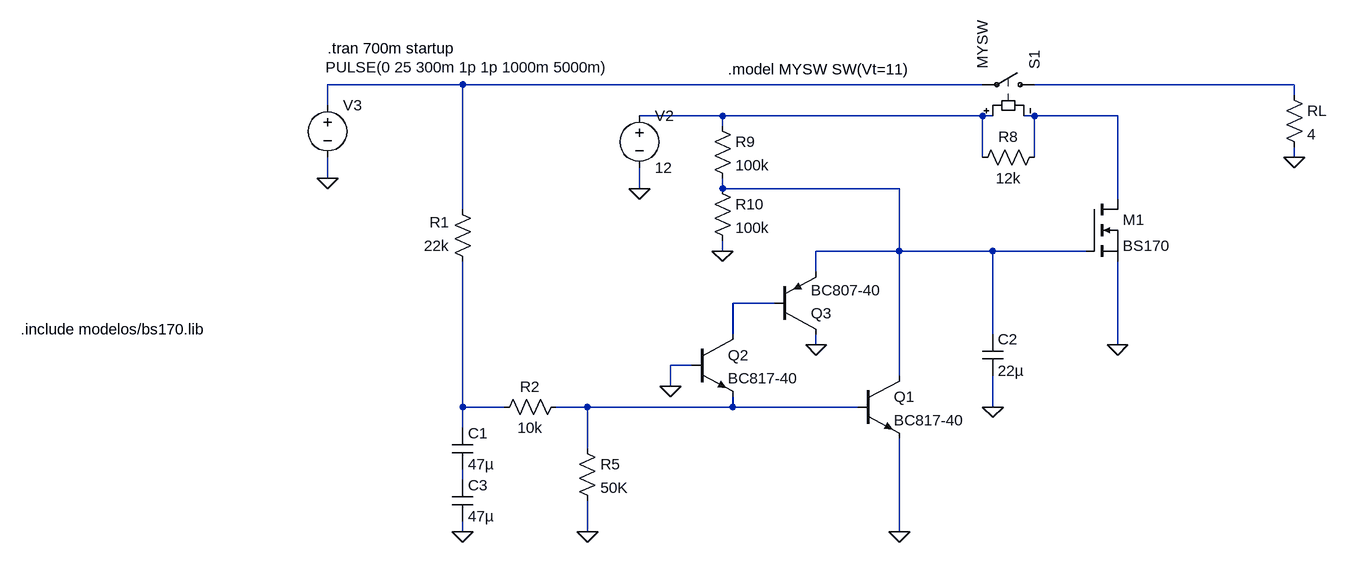
[diagram p0: schematic proteccion_parlante_DC.asc]
proteccion_parlante_DC.asc, the LTspice schematic file:
Version 4
SHEET 1 1752 680
WIRE -304 -304 -512 -304
WIRE 496 -304 -304 -304
WIRE 976 -304 576 -304
WIRE 976 -288 976 -304
WIRE -512 -272 -512 -304
WIRE 96 -256 -32 -256
WIRE 496 -256 96 -256
WIRE 512 -256 496 -256
WIRE 576 -256 560 -256
WIRE 704 -256 576 -256
WIRE 96 -240 96 -256
WIRE 496 -192 496 -256
WIRE 576 -192 576 -256
WIRE 976 -192 976 -208
WIRE -512 -160 -512 -192
WIRE -32 -144 -32 -176
WIRE 96 -144 96 -160
WIRE 368 -144 96 -144
WIRE 704 -128 704 -256
WIRE -304 -112 -304 -304
WIRE 96 -48 96 -64
WIRE 368 -48 368 -144
WIRE 368 -48 240 -48
WIRE 512 -48 368 -48
WIRE 656 -48 512 -48
WIRE 240 -16 240 -48
WIRE 176 32 112 32
WIRE 112 80 112 32
WIRE 512 80 512 -48
WIRE 240 96 240 80
WIRE 704 96 704 -32
WIRE 48 128 16 128
WIRE 368 144 368 -48
WIRE 16 160 16 128
WIRE -304 192 -304 -32
WIRE -240 192 -304 192
WIRE -112 192 -160 192
WIRE 112 192 112 176
WIRE 112 192 -112 192
WIRE 304 192 112 192
WIRE 512 192 512 144
WIRE -304 224 -304 192
WIRE -112 256 -112 192
WIRE -304 304 -304 288
WIRE -304 384 -304 368
WIRE -112 384 -112 336
WIRE 368 384 368 240
FLAG -304 384 0
FLAG 368 384 0
FLAG -32 -144 0
FLAG 512 192 0
FLAG 704 96 0
FLAG 240 96 0
FLAG 16 160 0
FLAG -112 384 0
FLAG 976 -192 0
FLAG -512 -160 0
FLAG 96 -48 0
SYMBOL cap -320 224 R0
SYMATTR InstName C1
SYMATTR Value 47µ
SYMBOL res -144 176 R90
WINDOW 0 0 56 VBottom 2
WINDOW 3 32 56 VTop 2
SYMATTR InstName R2
SYMATTR Value 10k
SYMBOL npn 304 144 R0
SYMATTR InstName Q1
SYMATTR Value BC817-40
SYMBOL voltage -32 -272 R0
WINDOW 123 0 0 Left 2
WINDOW 39 0 0 Left 2
SYMATTR InstName V2
SYMATTR Value 12
SYMBOL cap 496 80 R0
SYMATTR InstName C2
SYMATTR Value 22µ
SYMBOL nmos 656 -128 R0
SYMATTR InstName M1
SYMATTR Value BS170
SYMBOL res -288 -16 R180
WINDOW 0 36 76 Left 2
WINDOW 3 36 40 Left 2
SYMATTR InstName R1
SYMATTR Value 22k
SYMBOL npn 48 80 R0
SYMATTR InstName Q2
SYMATTR Value BC817-40
SYMBOL pnp 176 80 M180
SYMATTR InstName Q3
SYMATTR Value BC807-40
SYMBOL res -128 240 R0
SYMATTR InstName R5
SYMATTR Value 50K
SYMBOL sw 592 -304 M270
SYMATTR InstName S1
SYMATTR Value MYSW
SYMBOL res 960 -304 R0
SYMATTR InstName RL
SYMATTR Value 4
SYMBOL res 592 -208 R90
WINDOW 0 0 56 VBottom 2
WINDOW 3 32 56 VTop 2
SYMATTR InstName R8
SYMATTR Value 12k
SYMBOL voltage -512 -288 R0
WINDOW 123 0 0 Left 2
WINDOW 39 0 0 Left 2
WINDOW 3 -3 -43 Left 2
SYMATTR InstName V3
SYMATTR Value PULSE(0 25 300m 1p 1p 1000m 5000m)
SYMBOL res 80 -256 R0
SYMATTR InstName R9
SYMATTR Value 100k
SYMBOL res 80 -160 R0
SYMATTR InstName R10
SYMATTR Value 100k
SYMBOL cap -320 304 R0
SYMATTR InstName C3
SYMATTR Value 47µ
TEXT -512 -360 Left 2 !.tran 700m startup
TEXT 104 -328 Left 2 !.model MYSW SW(Vt=11)
TEXT -984 72 Left 2 !.include modelos/bs170.lib

The netlist it stands for:
* proteccion_parlante_DC.asc
C1 N007 N009 47µ
R2 N008 N007 10k
Q1 N005 N008 0 0 BC817-40
V2 N003 0 12
C2 N005 0 22µ
M1 N004 N005 0 0 BS170
R1 N007 N001 22k
Q2 N006 0 N008 0 BC817-40
Q3 0 N006 N005 0 BC807-40
R5 N008 0 50K
S1 N002 N001 N003 N004 MYSW
RL N002 0 4
R8 N004 N003 12k
V3 N001 0 PULSE(0 25 300m 1p 1p 1000m 5000m)
R9 N003 N005 100k
R10 N005 0 100k
C3 N009 0 47µ
.model NPN NPN
.model PNP PNP
.lib standard.bjt
.model NMOS NMOS
.model PMOS PMOS
.lib standard.mos
.tran 700m startup
.model MYSW SW(Vt=11)
.include modelos/bs170.lib
.backanno
.end